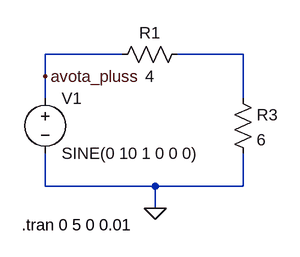
[diagram p0: schematic DC_elements.asc]
DC_elements.asc, the LTspice schematic file:
Version 4
SHEET 1 880 680
WIRE 256 64 144 64
WIRE 432 64 336 64
WIRE 144 96 144 64
WIRE 144 128 144 96
WIRE 432 128 432 64
WIRE 144 256 144 208
WIRE 304 256 144 256
WIRE 432 256 432 208
WIRE 432 256 304 256
WIRE 304 288 304 256
FLAG 304 288 0
FLAG 144 96 avota_pluss
SYMBOL voltage 144 112 R0
WINDOW 123 0 0 Left 0
WINDOW 39 0 0 Left 0
SYMATTR InstName V1
SYMATTR Value SINE(0 10 1 0 0 0)
SYMBOL res 240 80 R270
WINDOW 0 32 56 VTop 2
WINDOW 3 0 56 VBottom 2
SYMATTR InstName R1
SYMATTR Value 4
SYMBOL res 416 112 R0
SYMATTR InstName R3
SYMATTR Value 6
TEXT 110 312 Left 2 !.tran 0 5 0 0.01

The netlist it stands for:
* DC_elements.asc
V1 avota_pluss 0 SINE(0 10 1 0 0 0)
R1 avota_pluss N001 4
R3 N001 0 6
.tran 0 5 0 0.01
.backanno
.end